# EAGLE design billdetect_ring2b (EAGLE 6.6.0)
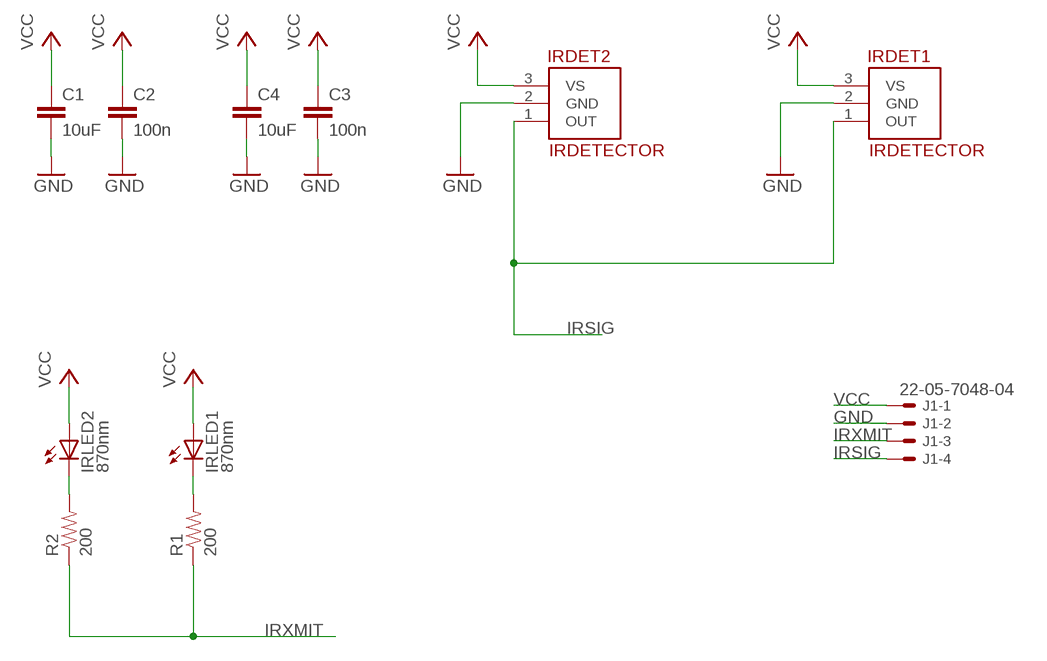
[diagram p0: schematic, sheet 1]

## Parts
C1  10uF  CAP0805  [0805]
C2  100n  CAP0805  [0805]
C3  100n  CAP0805  [0805]
C4  10uF  CAP0805  [0805]
IRDET1  IRDETECTOR  [TSOP-3PIN-2.54MM]
IRDET2  IRDETECTOR  [TSOP-3PIN-2.54MM]
IRLED1  870nm  LED-5MM-90DEG  [LED-5MM-90DEG]
IRLED2  870nm  LED-5MM-90DEG  [LED-5MM-90DEG]
J1  22-05-7048-04  [7395-04]
R1  200  RESISTOR0805-RES  [0805]
R2  200  RESISTOR0805-RES  [0805]

## Nets
GND: C1.2 C2.2 C3.2 C4.2 IRDET1.2(GND) IRDET2.2(GND) J1.2
IRSIG: IRDET1.1(OUT) IRDET2.1(OUT) J1.4
IRXMIT: J1.3 R1.1 R2.1
N$1: IRLED2.K(C) R2.2
N$3: IRLED1.K(C) R1.2
VCC: C1.1 C2.1 C3.1 C4.1 IRDET1.3(VS) IRDET2.3(VS) IRLED1.A IRLED2.A J1.1

## Library data of the parts
C1-C4 = SparkFun-20110517:CAP: Capacitor Standard 0603 ceramic capacitor, and 0.1" leaded capacitor.
IRDET1 IRDET2 = todstuff:IRDETECTOR: Vishay TSOP348.., TSOP344.. IR receiver modules CARRIER FREQUENCY STD (AGC2,AGC8) NOISY ENV(AGC4) 30 kHz TSOP34830 TSOP34430 33 kHz TSOP34833 TSOP34433 36 kHz TSOP34836 TSOP34436 38 kHz TSOP34838 TSOP34438 40 kHz TSOP34840 TSOP34440 56 kHz TSOP34856 TSOP34456
IRLED1 IRLED2 = dp_devices:LED: Light Emitting Diode
J1 = con-molex:22-?-04: CONNECTOR wire to board 2.54 mm (.1 inch) pitch header; OC_FARNELL: unknown; OC_NEWARK: unknown
R1 R2 = SparkFun-Passives:RESISTOR: Resistor Basic schematic elements and footprints for 0603, 1206, and PTH resistors.

## Board
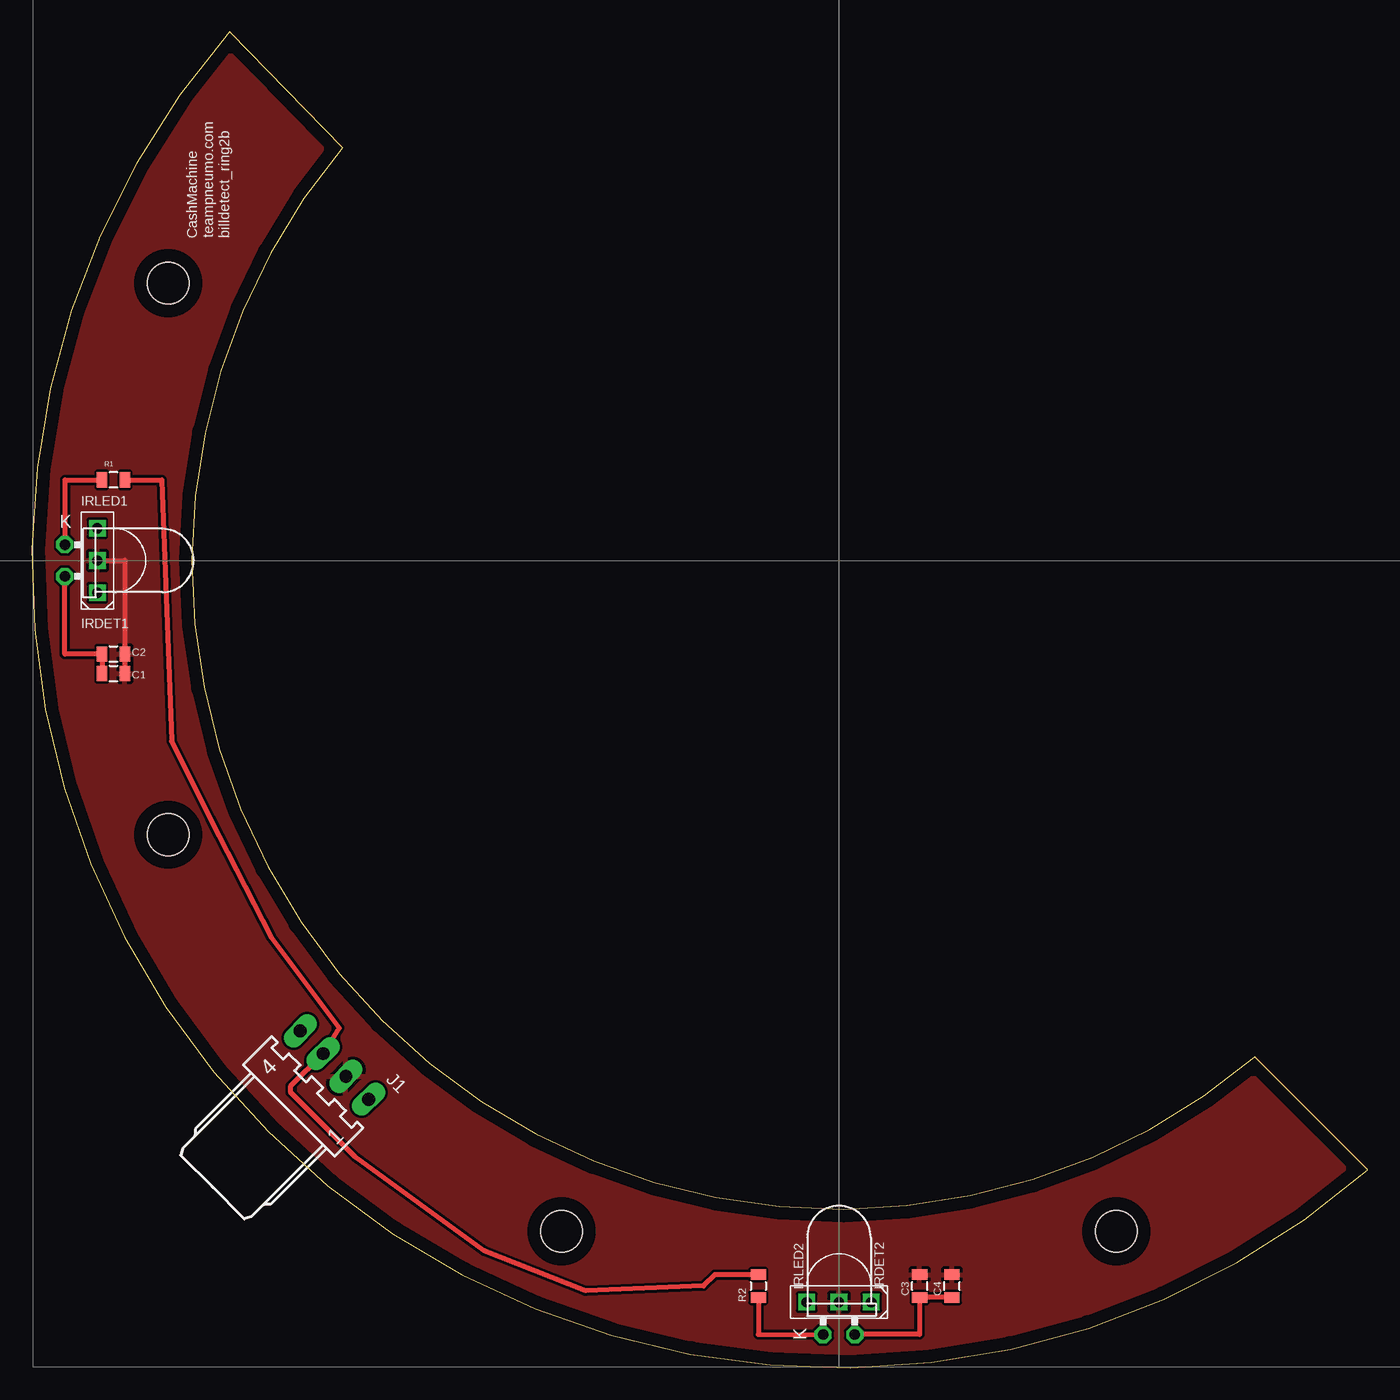
[diagram p1: board, top side]
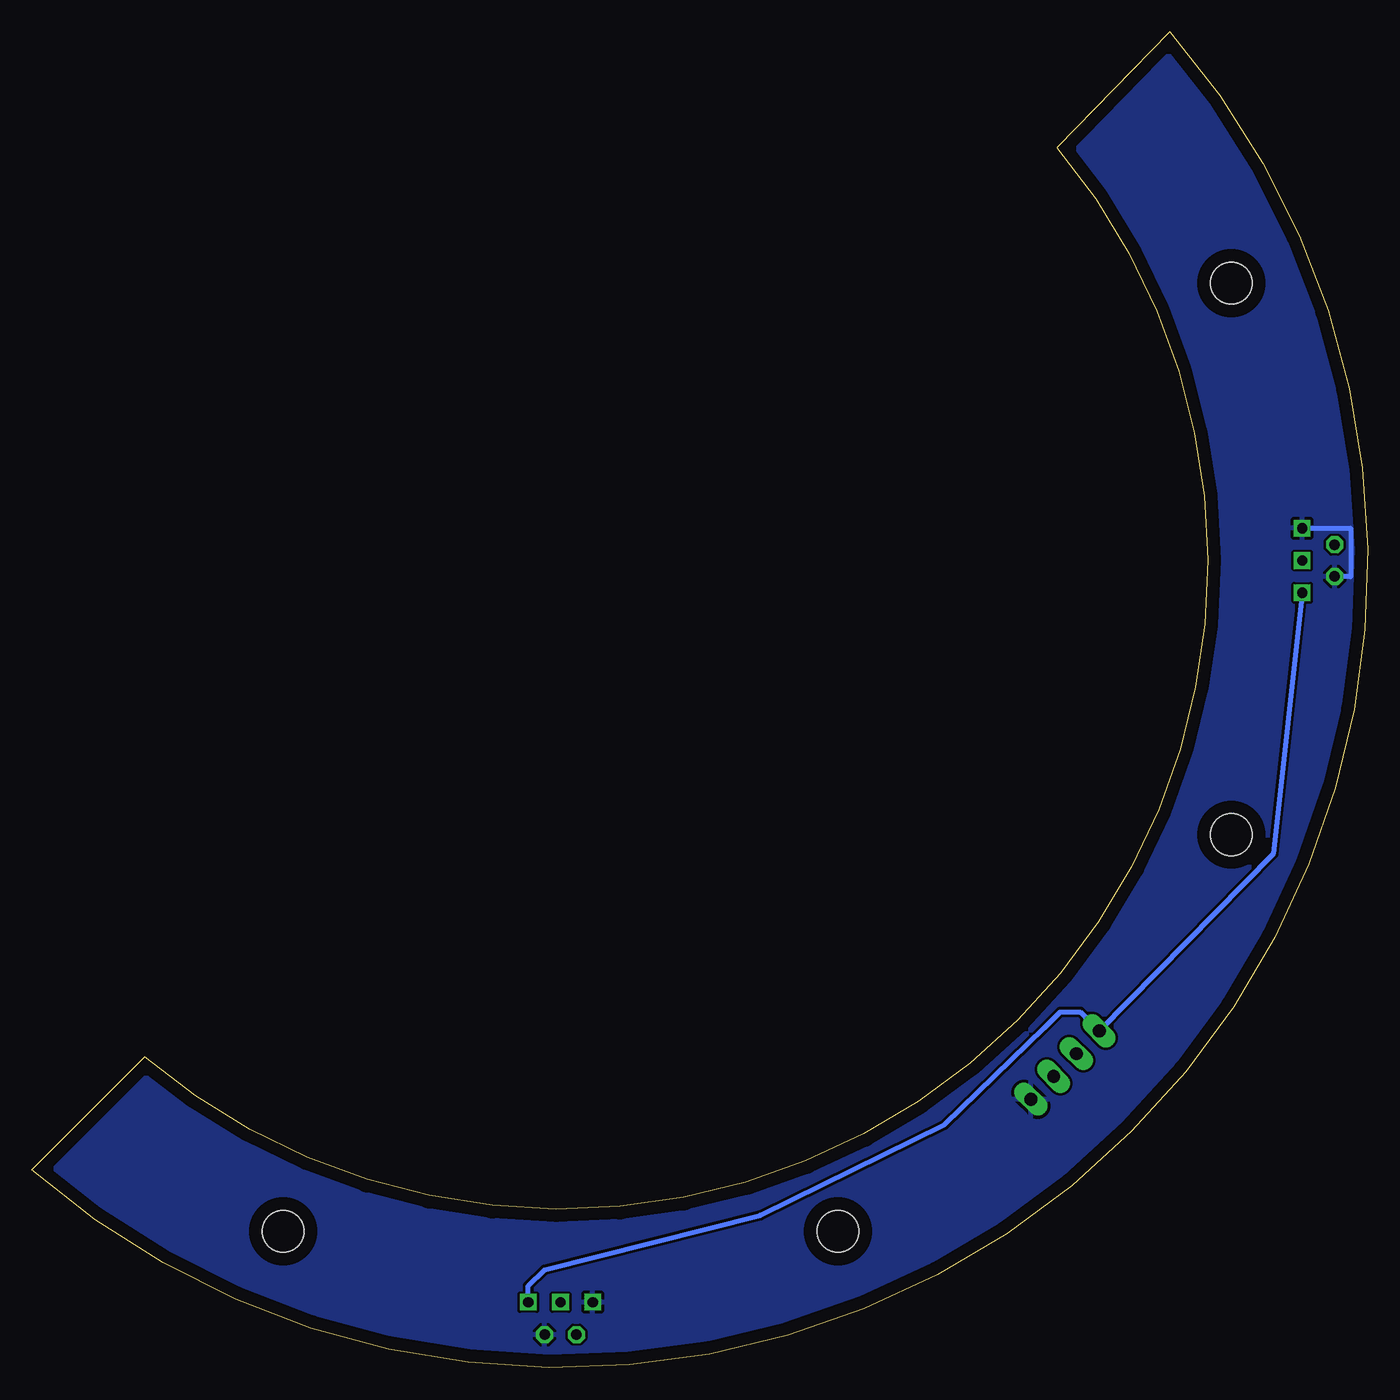
[diagram p2: board, bottom side, seen from below]

Size 105.24 x 105.24 mm. Coordinates in mm from the lower left corner, seen from the top.
Outline: 24.47,96.1 arc170 96.35,24.47 105.24,15.58 arc-172 15.58,105.24 24.47,96.1
Copper layers (1*16): Top 0.035mm / dielectric 1.5mm / Bottom 0.035mm
Design rules "default": minimum track width 10mil, minimum drill 24mil, track to track 8mil, track to pad 8mil, pad to pad 8mil, via to via 8mil, smd to smd 8mil, copper to edge 40mil, drill to drill 8mil, minimum pad ring 10mil, minimum via ring 8mil, stop-mask expansion 4mil, vias tented up to drill 0mil, thermal gap 10mil

### Footprints (pad centres in the part's own frame; a part is rotated, then mirrored left to right if it is on the bottom)
0805 = smd 0.8 x 1.2: 1 -0.9,0; 2 0.9,0
TSOP-3PIN-2.54MM = drill 0.8 square: 1 5.08,0; 2 2.54,0; 3 0,0
LED-5MM-90DEG = drill 0.813 octagon: A 5.1,1.25; K 5.1,-1.25
7395-04 = drill 1.016 long: 1 3.81,0; 2 1.27,0; 3 -1.27,0; 4 -3.81,0
STAND-OFF = hole 3.302: 0,0

### Placement (x,y rotation side)
C1  6.44,54.7 0 top
C2  6.44,56.22 0 top
C3  69.94,6.44 90 top
C4  72.48,6.44 90 top
IRDET1  5.17,66.13 270 top
IRDET2  61.05,5.17 0 top
IRLED1  7.71,63.59 180 top
IRLED2  63.59,7.71 270 top
J1  23.85,23.85 315 top
R1  6.44,69.94 180 top
R2  57.24,6.44 270 top
U$1  [STAND-OFF]  85.43,10.76 0 top
U$3  [STAND-OFF]  10.76,85.43 0 top
U$5  [STAND-OFF]  10.76,42 0 top
U$6  [STAND-OFF]  41.74,10.76 0 top

### Tracks (layer width: path | path; a pad name or v marks a point on that pad's centre or on a via)
GND
  Top 0.406: C1.2 C2.2 7.34,63.59 IRDET1.2
  pour Top: -2.2,79.08 -2.45,-2.45 105.5,-2.45 111.59,17.87 18.12,111.09
IRSIG
  Bottom 0.406: IRDET1.1 7.45,40.47 J1.4 22.64,28.03 24.22,28.03 25.49,26.76 33.36,19.14 47.84,12.03 64.86,7.71 66.13,6.44 IRDET2.1
IRXMIT
  Top 0.406: R1.1 10.25,69.94 11.01,49.36 14.06,43.27 18.88,33.87 24.22,26.76 J1.3 20.41,22.2 20.41,21.68 25.49,16.6 35.65,9.23 43.64,6.07 52.92,6.44 53.82,7.34 R2.1
N$1
  Top 0.406: R2.2 57.24,2.63 IRLED2.K
N$3
  Top 0.406: IRLED1.K 2.63,64.84 2.63,69.94 R1.2
VCC
  Top 0.406: C1.1 C2.1 2.61,56.22 IRLED1.A | C4.1 C3.1 69.94,2.63 64.86,2.63 IRLED2.A
  Bottom 0.406: IRDET1.3 1.36,66.13 1.36,62.32 2.61,62.32 IRLED1.A
  pour Bottom: 19.14,110.58 109.31,20.41 109.31,10.25 96.61,-2.45 -1.18,-2.45 -1.18,91.53 17.87,110.58

### Text on the board
tPlace: teampneumo.com
tNames: CashMachine | billdetect_ring2b
Document: CashMachine | Sensor Board v2 | teampneumo.com | todbot.com